# EAGLE design Oscilador_555_r00 (EAGLE 7.5.0)
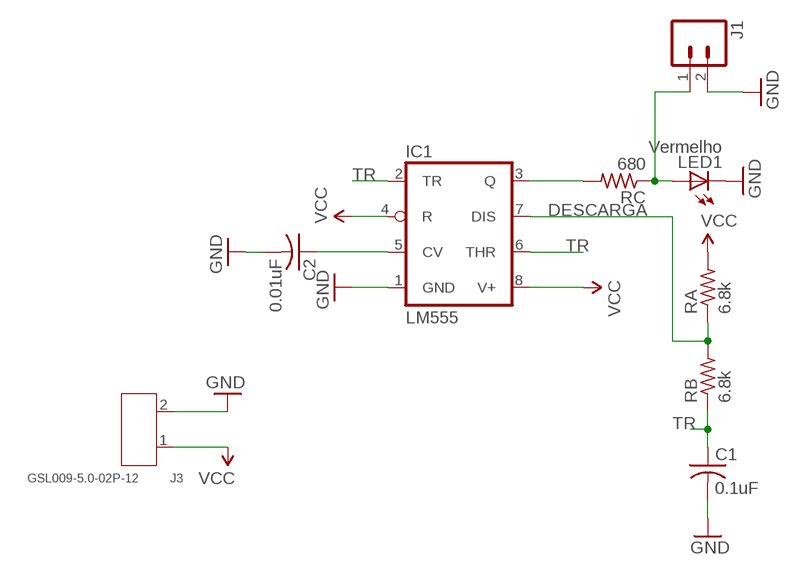
[diagram p0: schematic, sheet 1]

## Parts
C1  0.1uF  C-US050-024X044  [C050-024X044]
C2  0.01uF  C-US050-024X044  [C050-024X044]
IC1  LM555  LM555N  [DIL08-ROUND]
J1  M02PTH  [1X02]
J3  GSL009-5.0-02P-12  SCREW-TERMINAL-BLUE(2P-5.0)  [H2-5.0-10.5X8.0MM]
LED1  Vermelho  LED5MM  [LED5MM]
RA  6.8k  R-US_0207/10  [0207/10]
RB  6.8k  R-US_0207/10  [0207/10]
RC  680  R-US_0207/10  [0207/10]

## Nets
DESCARGA: IC1.7(DIS) RA.1 RB.2
GND: C1.2 C2.2 IC1.1(GND) J1.2 J3.2 LED1.K(C)
N$2: C2.1 IC1.5(CV)
N$3: J1.1 LED1.A RC.1
N$4: IC1.3(Q) RC.2
TR: C1.1 IC1.2(TR) IC1.6(THR) RB.1
VCC: IC1.4(R) IC1.8(V+) J3.1 RA.2

## Library data of the parts
C1 C2 = adafruit:C-US: CAPACITOR, American symbol
IC1 = adafruit:*555: TIMER Changed DIP package to have round (not oval) pin pads http://www.ladyada.net/library/pcb/eaglelibrary.html
J1 = SparkFun-Connectors:M02: Standard 2-pin 0.1" header. Use with - straight break away headers ( PRT-00116) - right angle break away headers (PRT-00553) - swiss pins (PRT-00743) - machine pins (PRT-00117) - female headers (PRT-00115) Molex polarized connector foot print use with: PRT-08233 with associated crimp pins and housings. 2.54_SCREWTERM for use with PRT-10571. 3.5mm Screw Terminal footprints for PRT-08084 5mm Screw Terminal footprints for use with PRT-08432
J3 = Seeed-OPL-Connector:SCREW-TERMINAL-BLUE(2P-5.0): 320120007; MPN: GSL009-5.0-02P-12
LED1 = adafruit:LED: LED OSRAM: - CHIPLED LG R971, LG N971, LY N971, LG Q971, LY Q971, LO R971, LY R971 LH N974, LH R974 LS Q976, LO Q976, LY Q976 LO Q996 - Hyper CHIPLED LW Q18S LB Q993, LB Q99A, LB R99A - SideLED LS A670, LO A670, LY A670, LG A670, LP A670 LB A673, LV A673, LT A673, LW A673 LH A674 LY A675 LS A676, LA A676, LO A676, LY A676, LW A676 LS A679, LY A679, LG A679 - Hyper Micro SIDELED® LS Y876, LA Y876, LO Y876, LY Y876 LT Y87S - SmartLED LW L88C, LW L88S LB L89C, LB L89S, LG L890 LS L89K, LO L89K, LY L89K LS L896, LA L896, LO L896, LY L896 - TOPLED LS T670, LO T670, LY T670, LG T670, LP T670 LSG T670, LSP T670, LSY T670, LOP T670, LYG T670 LG T671, LOG T671, LSG T671 LB T673, LV T673, LT T673, LW T673 LH T674 LS T676, LA T676, LO T676, LY T676, LB T676, LH T676, LSB T676, LW T676 LB T67C, LV T67C, LT T67C, LS T67K, LO T67K, LY T67K, LW E67C LS E67B, LA E67B, LO E67B, LY E67B, LB E67C, LV E67C, LT E67C LW T67C LS T679, LY T679, LG T679 LS T770, LO T770, LY T770, LG T770, LP T770 LB T773, LV T773, LT T773, LW T773 LH T774 LS E675, LA E675, LY E675, LS T675 LS T776, LA T776, LO T776, LY T776, LB T776 LHGB T686 LT T68C, LB T68C - Hyper Mini TOPLED® LB M676 - Mini TOPLED Santana® LG M470 LS M47K, LO M47K, LY M47K Source: http://www.osram.convergy.de/
RA RB RC = adafruit:R-US_: RESISTOR, American symbol

## Board
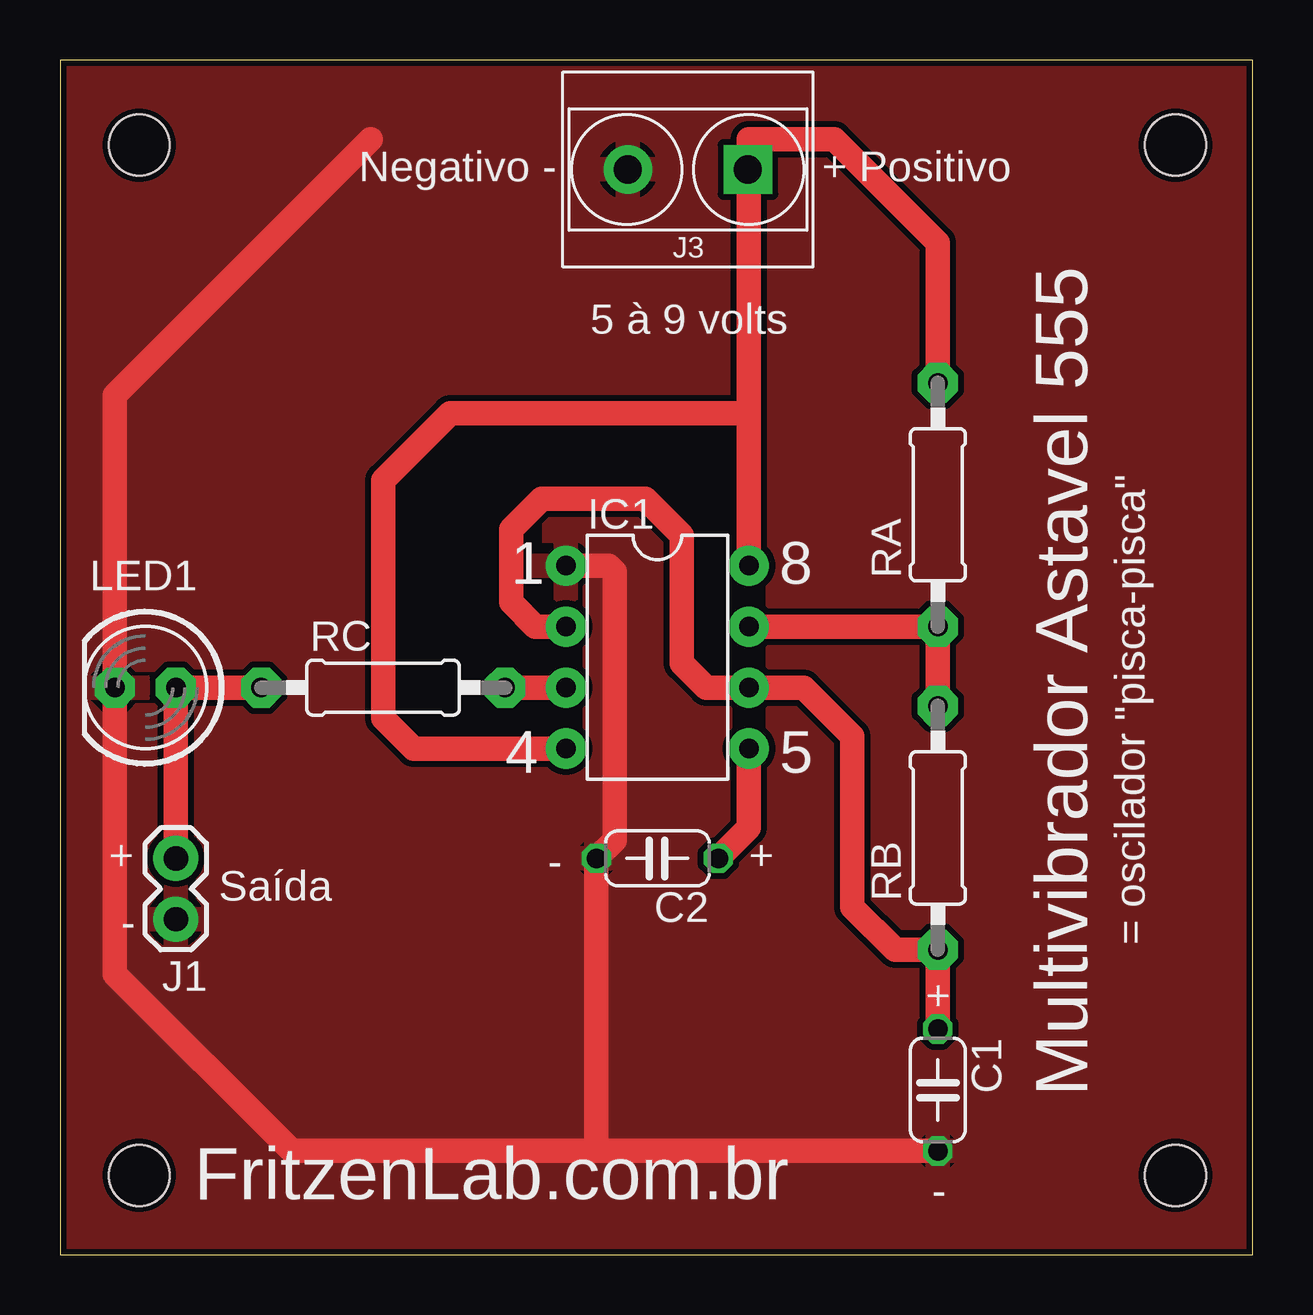
[diagram p1: board, top side]

Size 49.71 x 49.77 mm. Coordinates in mm from the lower left corner, seen from the top.
Outline: 0,0 49.71,0 49.71,49.77 0,49.77 0,0
Copper layers (1*16): Top 0.035mm / dielectric 1.6mm / Bottom 0.035mm
Design rules "Elecrow_2-layer_PCB_eagle_rule *": minimum track width 6mil, minimum drill 12mil, track to track 10mil, track to pad 10mil, pad to pad 10mil, via to via 10mil, smd to smd 0mil, copper to edge 10mil, drill to drill 10mil, minimum pad ring 6mil, minimum via ring 6mil, stop-mask expansion 0mil, vias tented up to drill 100mil, thermal gap 10mil
Holes 2.54 mm at 3.3,46.23 46.48,46.23 3.3,3.3 46.48,3.3

### Footprints (pad centres in the part's own frame; a part is rotated, then mirrored left to right if it is on the bottom)
C050-024X044 = drill 0.813 octagon: 1 -2.54,0; 2 2.54,0
DIL08-ROUND = drill 0.813 pad 1.676: 1 -3.81,-3.81; 2 -1.27,-3.81; 3 1.27,-3.81; 4 3.81,-3.81; 5 3.81,3.81; 6 1.27,3.81; 7 -1.27,3.81; 8 -3.81,3.81
1X02 = drill 1.016 pad 1.88: 1 0,0; 2 2.54,0
H2-5.0-10.5X8.0MM = drill 1.168 pad 2.032 square: 1 0,2.5 | drill 1.168 pad 2.032: 2 0,-2.5
LED5MM = drill 0.813 pad 1.676 octagon: A -1.27,0; K 1.27,0
0207/10 = drill 0.813 pad 1.676 octagon: 1 -5.08,0; 2 5.08,0

### Placement (x,y rotation side)
C1  36.58,6.86 270 top
C2  24.89,16.51 180 top
IC1  24.89,24.89 270 top
J1  4.83,16.51 270 top
J3  26.16,45.21 270 top
LED1  3.56,23.62 180 top
RA  36.58,31.24 90 top
RB  36.58,17.78 90 top
RC  13.46,23.62 0 top

### Tracks (layer width: path | path; a pad name or v marks a point on that pad's centre or on a via)
DESCARGA
  Top 1.016: IC1.7 RA.1 RB.2
GND
  Top 1.016: 12.95,46.48 2.29,35.81 LED1.K 2.29,11.68 9.65,4.32 22.35,4.32 | C1.2 22.35,4.32 | 22.35,4.32 C2.2 23.11,17.27 23.11,28.45 22.86,28.7 IC1.1
  pour Top: 0,0 49.78,0 49.78,49.78 0,49.78
N$2
  Top 1.016: IC1.5 28.7,17.78 C2.1
N$3
  Top 1.016: RC.1 LED1.A J1.1
N$4
  Top 1.016: IC1.3 RC.2
TR
  Top 1.016: C1.1 RB.1 34.8,12.7 33.02,14.48 33.02,21.59 30.99,23.62 IC1.6 26.92,23.62 25.91,24.64 25.91,29.97 24.38,31.5 20.07,31.5 18.8,30.23 18.8,27.18 19.81,26.16 IC1.2
VCC
  Top 1.016: RA.2 36.58,42.16 32.26,46.48 28.7,46.48 28.7,45.72 28.7,45.21 | IC1.8 28.7,35.05 | 28.7,35.05 28.7,45.21 | IC1.4 14.73,21.08 13.46,22.35 13.46,32.26 16.26,35.05 28.7,35.05 | J3.1 28.7,45.21

### Text on the board
tNames: Negativo - | + Positivo | Multivibrador Astavel 555 | 5 à 9 volts | = oscilador "pisca-pisca" | 1 | 8 | 4 | 5 | + | - | + | Saída | - | + | FritzenLab.com.br | -